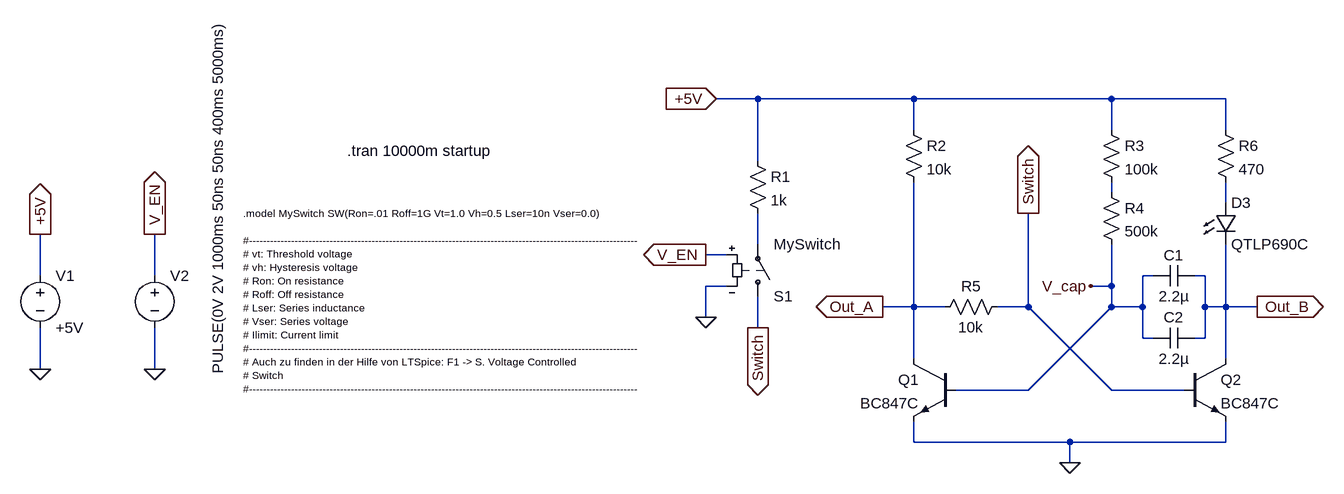
[diagram p0: schematic Projekt_7_Monostabile_Kippstufe.asc]
Projekt_7_Monostabile_Kippstufe.asc, the LTspice schematic file:
Version 4
SHEET 1 1768 680
WIRE 576 -304 512 -304
WIRE 816 -304 576 -304
WIRE 1120 -304 816 -304
WIRE 1296 -304 1120 -304
WIRE 816 -256 816 -304
WIRE 1120 -256 1120 -304
WIRE 1296 -256 1296 -304
WIRE 576 -208 576 -304
WIRE 1120 -160 1120 -176
WIRE 1296 -144 1296 -176
WIRE 576 -80 576 -128
WIRE 528 -64 496 -64
WIRE -528 -32 -528 -96
WIRE -352 -32 -352 -96
WIRE 1184 -32 1168 -32
WIRE 1264 -32 1248 -32
WIRE 528 -16 496 -16
WIRE 1120 -16 1120 -80
WIRE 1120 -16 1088 -16
WIRE 816 16 816 -176
WIRE 816 16 768 16
WIRE 864 16 816 16
WIRE 992 16 992 -128
WIRE 992 16 944 16
WIRE 1120 16 1120 -16
WIRE 1168 16 1168 -32
WIRE 1168 16 1120 16
WIRE 1264 16 1264 -32
WIRE 1296 16 1296 -80
WIRE 1296 16 1264 16
WIRE 1344 16 1296 16
WIRE 496 32 496 -16
WIRE 576 48 576 0
WIRE 1168 64 1168 16
WIRE 1184 64 1168 64
WIRE 1264 64 1264 16
WIRE 1264 64 1248 64
WIRE 816 96 816 16
WIRE 1296 96 1296 16
WIRE -528 112 -528 48
WIRE -352 112 -352 48
WIRE 992 144 1120 16
WIRE 992 144 880 144
WIRE 1120 144 992 16
WIRE 1232 144 1120 144
WIRE 816 224 816 192
WIRE 1056 224 816 224
WIRE 1296 224 1296 192
WIRE 1296 224 1056 224
WIRE 1056 256 1056 224
FLAG -528 112 0
FLAG -528 -96 +5V
IOPIN -528 -96 Out
FLAG 512 -304 +5V
IOPIN 512 -304 In
FLAG 1056 256 0
FLAG 768 16 Out_A
IOPIN 768 16 Out
FLAG 1344 16 Out_B
IOPIN 1344 16 Out
FLAG -352 -96 V_EN
IOPIN -352 -96 Out
FLAG -352 112 0
FLAG 496 -64 V_EN
IOPIN 496 -64 Out
FLAG 496 32 0
FLAG 1088 -16 V_cap
FLAG 576 48 Switch
IOPIN 576 48 Out
FLAG 992 -128 Switch
IOPIN 992 -128 Out
SYMBOL voltage -528 -48 R0
WINDOW 123 0 0 Left 2
WINDOW 39 0 0 Left 2
SYMATTR InstName V1
SYMATTR Value +5V
SYMBOL LED 1280 -144 R0
SYMATTR InstName D3
SYMATTR Value QTLP690C
SYMBOL sw 576 16 M180
SYMATTR InstName S1
SYMATTR Value MySwitch
SYMBOL voltage -352 -48 R0
WINDOW 3 97 -376 VRight 2
WINDOW 123 0 0 Left 2
WINDOW 39 0 0 Left 2
SYMATTR Value PULSE(0V 2V 1000ms 50ns 50ns 400ms 5000ms)
SYMATTR InstName V2
SYMBOL res 560 -224 R0
SYMATTR InstName R1
SYMATTR Value 1k
SYMBOL res 800 -272 R0
SYMATTR InstName R2
SYMATTR Value 10k
SYMBOL res 1104 -272 R0
SYMATTR InstName R3
SYMATTR Value 100k
SYMBOL res 1104 -176 R0
SYMATTR InstName R4
SYMATTR Value 500k
SYMBOL res 960 0 R90
WINDOW 0 0 56 VBottom 2
WINDOW 3 32 56 VTop 2
SYMATTR InstName R5
SYMATTR Value 10k
SYMBOL res 1280 -272 R0
SYMATTR InstName R6
SYMATTR Value 470
SYMBOL npn 880 96 M0
SYMATTR InstName Q1
SYMATTR Value BC847C
SYMBOL npn 1232 96 R0
SYMATTR InstName Q2
SYMATTR Value BC847C
SYMBOL cap 1184 -16 R270
WINDOW 0 32 32 VTop 2
WINDOW 3 0 32 VBottom 2
SYMATTR InstName C1
SYMATTR Value 2.2µ
SYMATTR SpiceLine V=16 Irms=8.48 Rser=0.0119581 Lser=0 mfg="KEMET" pn="C1210C225K4RAC" type="X7R"
SYMBOL cap 1184 80 R270
WINDOW 0 32 32 VTop 2
WINDOW 3 0 32 VBottom 2
SYMATTR InstName C2
SYMATTR Value 2.2µ
SYMATTR SpiceLine V=16 Irms=8.48 Rser=0.0119581 Lser=0 mfg="KEMET" pn="C1210C225K4RAC" type="X7R"
TEXT -56 -224 Left 2 !.tran 10000m startup
TEXT -216 -128 Left 1 !.model MySwitch SW(Ron=.01 Roff=1G Vt=1.0 Vh=0.5 Lser=10n Vser=0.0)\n \n#---------------------------------------------------------------------------------------------------------------\n# vt: Threshold voltage\n# vh: Hysteresis voltage\n# Ron: On resistance\n# Roff: Off resistance\n# Lser: Series inductance\n# Vser: Series voltage\n# Ilimit: Current limit\n#---------------------------------------------------------------------------------------------------------------\n# Auch zu finden in der Hilfe von LTSpice: F1 -> S. Voltage Controlled\n# Switch\n#---------------------------------------------------------------------------------------------------------------

The netlist it stands for:
* Projekt_7_Monostabile_Kippstufe.asc
V1 +5V 0 +5V
D3 N002 Out_B QTLP690C
S1 Switch N003 V_EN 0 MySwitch
V2 V_EN 0 PULSE(0V 2V 1000ms 50ns 50ns 400ms 5000ms)
R1 +5V N003 1k
R2 +5V Out_A 10k
R3 +5V N001 100k
R4 N001 V_cap 500k
R5 Switch Out_A 10k
R6 +5V N002 470
Q1 Out_A V_cap 0 0 BC847C
Q2 Out_B Switch 0 0 BC847C
C1 V_cap Out_B 2.2µ V=16 Irms=8.48 Rser=0.0119581 Lser=0 mfg="KEMET" pn="C1210C225K4RAC" type="X7R"
C2 V_cap Out_B 2.2µ V=16 Irms=8.48 Rser=0.0119581 Lser=0 mfg="KEMET" pn="C1210C225K4RAC" type="X7R"
.model D D
.lib standard.dio
.model NPN NPN
.model PNP PNP
.lib standard.bjt
.tran 10000m startup
.model MySwitch SW(Ron=.01 Roff=1G Vt=1.0 Vh=0.5 Lser=10n Vser=0.0)
#---------------------------------------------------------------------------------------------------------------
# vt: Threshold voltage
# vh: Hysteresis voltage
# Ron: On resistance
# Roff: Off resistance
# Lser: Series inductance
# Vser: Series voltage
# Ilimit: Current limit
#---------------------------------------------------------------------------------------------------------------
# Auch zu finden in der Hilfe von LTSpice: F1 -> S. Voltage Controlled
# Switch
#---------------------------------------------------------------------------------------------------------------
.backanno
.end

* Results of the author's LTspice run, read from the files saved beside the schematic
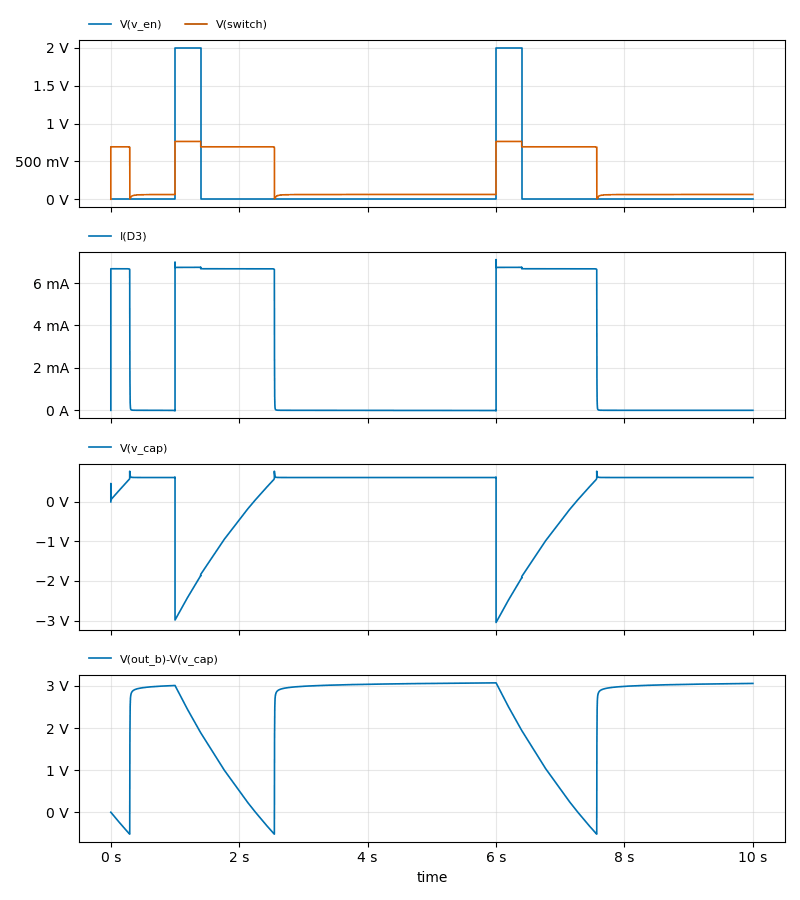
[diagram p1: Transient Analysis of Projekt_7_Monostabile_Kippstufe.asc, plotted from the saved traces]
* Transient Analysis, 1 run:
*   V(v_en): min 0 V, max 2 V, average 160 mV, rms 565.7 mV, last 0 V
*   V(switch): min 0 V, max 764.1 mV, average 282.2 mV, rms 417.6 mV, last 62.8 mV
*   I(D3): min -25.46 µA, max 7.107 mA, average 2.285 mA, rms 3.907 mA, last 71.35 nA
*   V(v_cap): min -3.051 V, max 774.4 mV, average 89.24 mV, rms 974.7 mV, last 614.4 mV
*   V(out_b)-V(v_cap): min -520.7 mV, max 3.072 V, average 2.319 V, rms 2.593 V, last 3.059 V